# Altium schematic sheet MCU.SchDoc
size 297 x 209 mm; SheetNumber: 3; SheetTotal: 3; SPICEModelCacheVLKWCBOF: <root> / <DocumentId>VLKWCBOF</DocumentId> / </root>
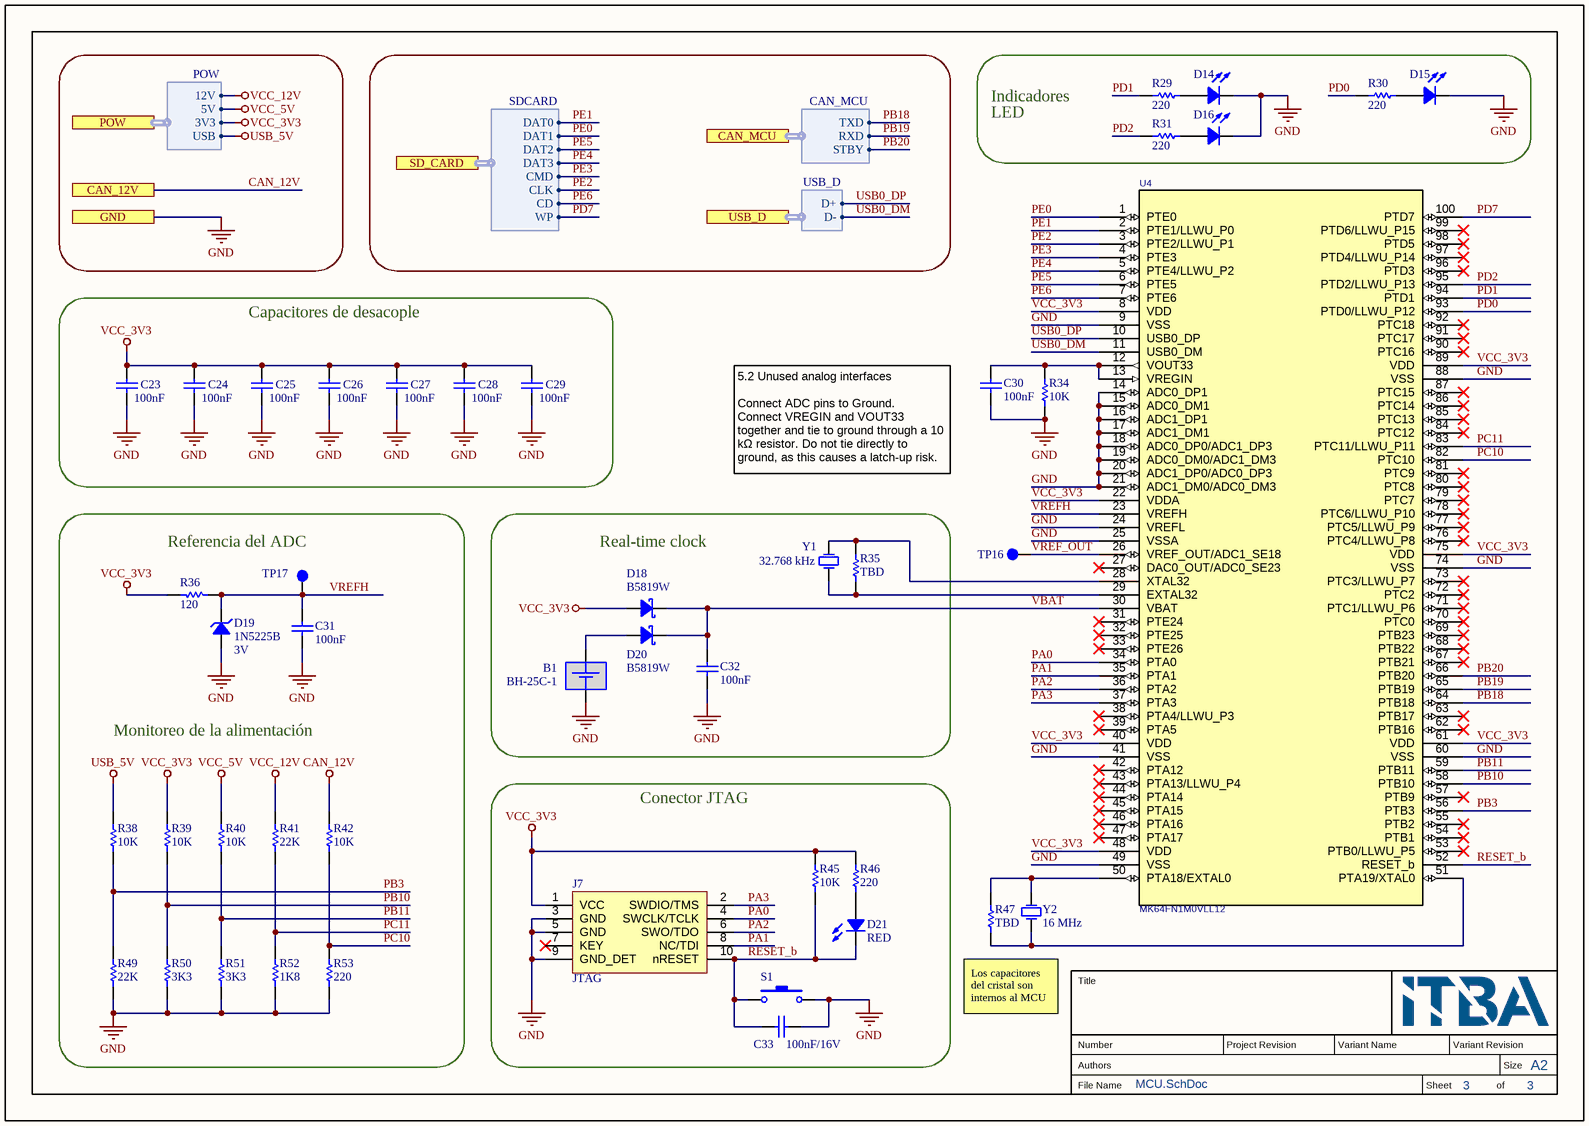
[diagram p0: MCU.SchDoc]

## Parts
B1  BH-25C-1  [COIN_CELL_HOLDER]
C23  100nF  [CAP0805]
C24  100nF  [CAP0805]
C25  100nF  [CAP0805]
C26  100nF  [CAP0805]
C27  100nF  [CAP0805]
C28  100nF  [CAP0805]
C29  100nF  [CAP0805]
C30  100nF  [CAP0805]
C31  100nF  [CAP0805]
C32  100nF  [CAP0805]
C33  100nF/16V  [CAP0805]
D14  RED  [LED-3MM-RED-RA]  (value not drawn)
D15  RED  [LED-3MM-RED-RA]  (value not drawn)
D16  RED  [LED-3MM-RED-RA]  (value not drawn)
D18  B5819W  [SOD-123]
D19  1N5225B  Voltage: 3V  [DO-35]
D20  B5819W  [SOD-123]
D21  RED  [LED-3MM-RED-RA]
J7  JTAG  [JTAG-10PIN]
R29  220  [RES0805]
R30  220  [RES0805]
R31  220  [RES0805]
R34  10K  [RES0805]
R35  TBD  [RES0805]
R36  120  [RES0805]
R38  10K  [RES0805]
R39  10K  [RES0805]
R40  10K  [RES0805]
R41  22K  [RES0805]
R42  10K  [RES0805]
R45  10K  [RES0805]
R46  220  [RES0805]
R47  TBD  [RES0805]
R49  22K  [RES0805]
R50  3K3  [RES0805]
R51  3K3  [RES0805]
R52  1K8  [RES0805]
R53  220  [RES0805]
S1  Tact Switch  [TACT SWITCH]  (value not drawn)
TP16  Testpoint  [TP_SMD_Ø1.0mm]  (value not drawn)  (no BOM)
TP17  Testpoint  [TP_SMD_Ø1.0mm]  (value not drawn)  (no BOM)
U4  MK64FN1M0VLL12  [QFP50P1600X1600X160-100N]
Y1  32.768 kHz  [XTAL-RAD-3X8]
Y2  16 MHz  [XTAL-HC-49S]

## Blocks framed on the sheet
Capacitores de desacople: C23-C29
Real-time clock: B1 C32 D18 D20 R35 Y1
Conector JTAG: C33 D21 J7 R45 R46 S1

## Ports
CAN_12V, CAN_MCU (harness CAN_MCU), GND, POW (harness POW), SD_CARD (harness SDCARD), USB_D (harness USB_D)

## Harnesses
CAN_MCU: TXD, RXD, STBY
USB_D: D+, D-
SDCARD: DAT0, DAT1, DAT2, DAT3, CMD, CLK, CD, WP
POW: 12V, 5V, 3V3, USB

## Nets
CAN_12V: R42.1 ; port CAN_12V
GND: B1.2 C23.1 C24.1 C25.1 C26.1 C27.1 C28.1 C29.1 C30.1 C31.1 C32.1 C33.1 D14.2(K) D15.2(K) D16.2(K) D19.2(A) J7.3(GND) J7.5(GND) J7.9(GND_DET) R34.1 R49.2 R50.2 R51.2 R52.2 R53.2 S1.2 U4.9(VSS) U4.14(ADC0_DP1) U4.15(ADC0_DM1) U4.16(ADC1_DP1) U4.17(ADC1_DM1) U4.18(ADC0_DP0/ADC1_DP3) U4.19(ADC0_DM0/ADC1_DM3) U4.20(ADC1_DP0/ADC0_DP3) U4.21(ADC1_DM0/ADC0_DM3) U4.24(VREFL) U4.25(VSSA) U4.41(VSS) U4.49(VSS) U4.60(VSS) U4.74(VSS) U4.88(VSS) ; port GND
USB_5V: R38.1 ; port POW.USB
VCC_3V3: C23.2 C24.2 C25.2 C26.2 C27.2 C28.2 C29.2 D18.1(A) J7.1(VCC) R36.2 R39.1 R45.2 R46.1 U4.8(VDD) U4.22(VDDA) U4.40(VDD) U4.48(VDD) U4.61(VDD) U4.75(VDD) U4.89(VDD) ; port POW.3V3
VCC_5V: R40.1 ; port POW.5V
VCC_12V: R41.1 ; port POW.12V
PA0: J7.4(SWCLK/TCLK) U4.34(PTA0)
PA1: J7.8(NC/TDI) U4.35(PTA1)
PA2: J7.6(SWO/TDO) U4.36(PTA2)
PA3: J7.2(SWDIO/TMS) U4.37(PTA3)
PB3: R38.2 R49.1 U4.56(PTB3)
PB10: R39.2 R50.1 U4.58(PTB10)
PB11: R40.2 R51.1 U4.59(PTB11)
PB18: U4.64(PTB18) ; port CAN_MCU.TXD
PB19: U4.65(PTB19) ; port CAN_MCU.RXD
PB20: U4.66(PTB20) ; port CAN_MCU.STBY
PC10: R42.2 R53.1 U4.82(PTC10)
PC11: R41.2 R52.1 U4.83(PTC11/LLWU_P11)
PD0: R30.1 U4.93(PTD0/LLWU_P12)
PD1: R29.1 U4.94(PTD1)
PD2: R31.1 U4.95(PTD2/LLWU_P13)
PD7: U4.100(PTD7) ; port SD_CARD.WP
PE0: U4.1(PTE0) ; port SD_CARD.DAT1
PE1: U4.2(PTE1/LLWU_P0) ; port SD_CARD.DAT0
PE2: U4.3(PTE2/LLWU_P1) ; port SD_CARD.CLK
PE3: U4.4(PTE3) ; port SD_CARD.CMD
PE4: U4.5(PTE4/LLWU_P2) ; port SD_CARD.DAT3
PE5: U4.6(PTE5) ; port SD_CARD.DAT2
PE6: U4.7(PTE6) ; port SD_CARD.CD
RESET_b: C33.2 D21.2(K) J7.10(nRESET) R45.1 S1.1 U4.52(RESET_b)
USB0_DM: U4.11(USB0_DM) ; port USB_D.D-
USB0_DP: U4.10(USB0_DP) ; port USB_D.D+
VBAT: C32.2 D18.2(K) D20.2(K) U4.30(VBAT)
VREF_OUT: TP16.1(TP) U4.26(VREF_OUT/ADC1_SE18)
VREFH: C31.2 D19.1(K) R36.1 TP17.1(TP) U4.23(VREFH)
NetB1_1: B1.1 D20.1(A)
NetC30_2: C30.2 R34.2 U4.12(VOUT33) U4.13(VREGIN)
NetD14_1: D14.1(A) R29.2
NetD15_1: D15.1(A) R30.2
NetD16_1: D16.1(A) R31.2
NetD21_1: D21.1(A) R46.2
NetR35_1: R35.1 U4.28(XTAL32) Y1.2(OSC2)
NetR35_2: R35.2 U4.29(EXTAL32) Y1.1(OSC1)
NetR47_1: R47.1 U4.51(PTA19/XTAL0) Y2.1(OSC1)
NetR47_2: R47.2 U4.50(PTA18/EXTAL0) Y2.2(OSC2)

Not connected (* = marked no-connect by the designer): J7 7(KEY)*; U4 27(DAC0_OUT/ADC0_SE23)* 31(PTE24)* 32(PTE25)* 33(PTE26)* 38(PTA4/LLWU_P3)* 39(PTA5)* 42(PTA12)* 43(PTA13/LLWU_P4)* 44(PTA14)* 45(PTA15)* 46(PTA16)* 47(PTA17)* 53(PTB0/LLWU_P5)* 54(PTB1)* 55(PTB2)* 57(PTB9)* 62(PTB16)* 63(PTB17)* 67(PTB21)* 68(PTB22)* 69(PTB23)* 70(PTC0)* 71(PTC1/LLWU_P6)* 72(PTC2)* 73(PTC3/LLWU_P7)* 76(PTC4/LLWU_P8)* 77(PTC5/LLWU_P9)* 78(PTC6/LLWU_P10)* 79(PTC7)* 80(PTC8)* 81(PTC9)* 84(PTC12)* 85(PTC13)* 86(PTC14)* 87(PTC15)* 90(PTC16)* 91(PTC17)* 92(PTC18)* 96(PTD3)* 97(PTD4/LLWU_P14)* 98(PTD5)* 99(PTD6/LLWU_P15)*

## Notes on the sheet
- LED
- Indicadores
- (near C30) 5.2 Unused analog interfaces
  Connect ADC pins to Ground.
  Connect VREGIN and VOUT33 together and tie to ground through a 10 kΩ resistor. Do not tie directly to ground, as this causes a latch-up risk.
- Referencia del ADC
- Monitoreo de la alimentación
- Los capacitores del cristal son internos al MCU
- Title
- File Name
- Number
- Authors
- Project Revision
- Variant Name
- Sheet
- Variant Revision
- of
- Size
- A2

## Library data of the parts
B1 = Battery Holder
C23-C33 = Capacitor: SMD 0805 Capacitor
D14-D16 D21 = LED 3mm Red RA: Red 3mm LED
D18 D20 = Diode Schottky: Schottky Diode
D19 = Diode Zener: Zener Diode
J7 = JTAG Header
R29-R31 R34-R36 R38-R42 R45-R47 R49-R53 = Resistor: SMD 0805 Resistor
S1 = Tactile Switch: 2-pin 6mm tactile switch (push-button); Published: 24-Mar-1999; LatestRevisionDate: 17-Jul-2002; LatestRevisionNote: Re-released for DXP Platform.; PackageReference: SPST-2; Publisher: Altium Limited; PackageDescription: Switch; 2 Leads
U4 = MK64FN1M0VLL12_1: 120 MHz ARM Cortex®-M4-based Microcontroller with FPU; FP_DESC: LQFP100; MFG: NXP; Footprint Checked: Assign OK, Footprint OK; MFG_PN: MK64FN1M0VLL12
Y1 = Crystal 32.768 kHz: Crystal Oscillator - Radial 3x8mm
Y2 = Crystal 16 MHz: Crystal Oscillator HS-49S; Published: 8-Jun-2000; LatestRevisionDate: 17-Jul-2002; LatestRevisionNote: Re-released for DXP Platform.; PackageReference: R38; Publisher: Altium Limited; PackageDescription: Crystal, Thru-Hole; 2 Leads; Body 3.1 x 8.2 mm (Dia.xH)